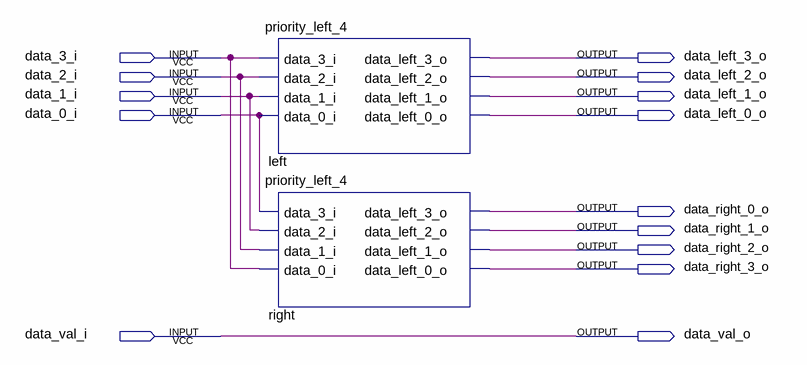
[diagram p0: schematic sheet]
// Quartus schematic priority_encoder_4.bdf as structural Verilog: 2 symbols, 14 pins
module priority_encoder_4 (
  input  data_3_i,
  input  data_2_i,
  input  data_1_i,
  input  data_0_i,
  input  data_val_i,
  output data_left_3_o,
  output data_left_2_o,
  output data_left_1_o,
  output data_left_0_o,
  output data_right_0_o,
  output data_right_1_o,
  output data_right_2_o,
  output data_right_3_o,
  output data_val_o
);

  priority_left_4 left (
    .data_3_i(data_3_i), .data_2_i(data_2_i), .data_1_i(data_1_i), .data_0_i(data_0_i),
    .data_left_3_o(data_left_3_o), .data_left_2_o(data_left_2_o), .data_left_1_o(data_left_1_o),
    .data_left_0_o(data_left_0_o));
  priority_left_4 right (
    .data_3_i(data_0_i), .data_2_i(data_1_i), .data_1_i(data_2_i), .data_0_i(data_3_i),
    .data_left_3_o(data_right_0_o), .data_left_2_o(data_right_1_o), .data_left_1_o(data_right_2_o),
    .data_left_0_o(data_right_3_o));

  assign data_val_o = data_val_i;
endmodule
